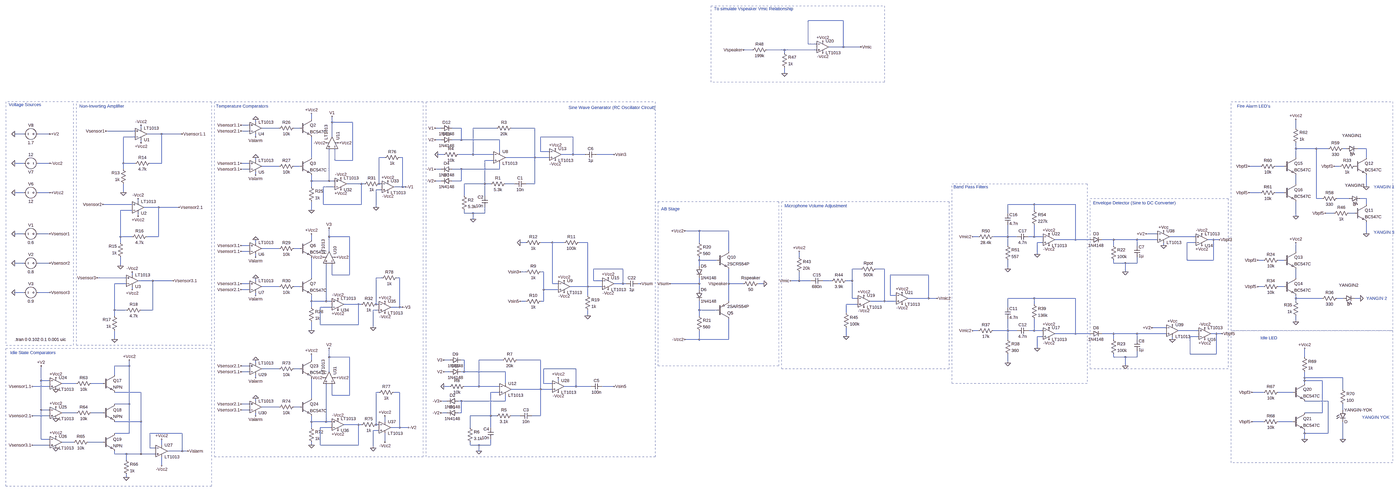
[diagram p0: schematic EE214_HalisYılmaz_RafetKavak_CircuitSchematic.asc, whole sheet]
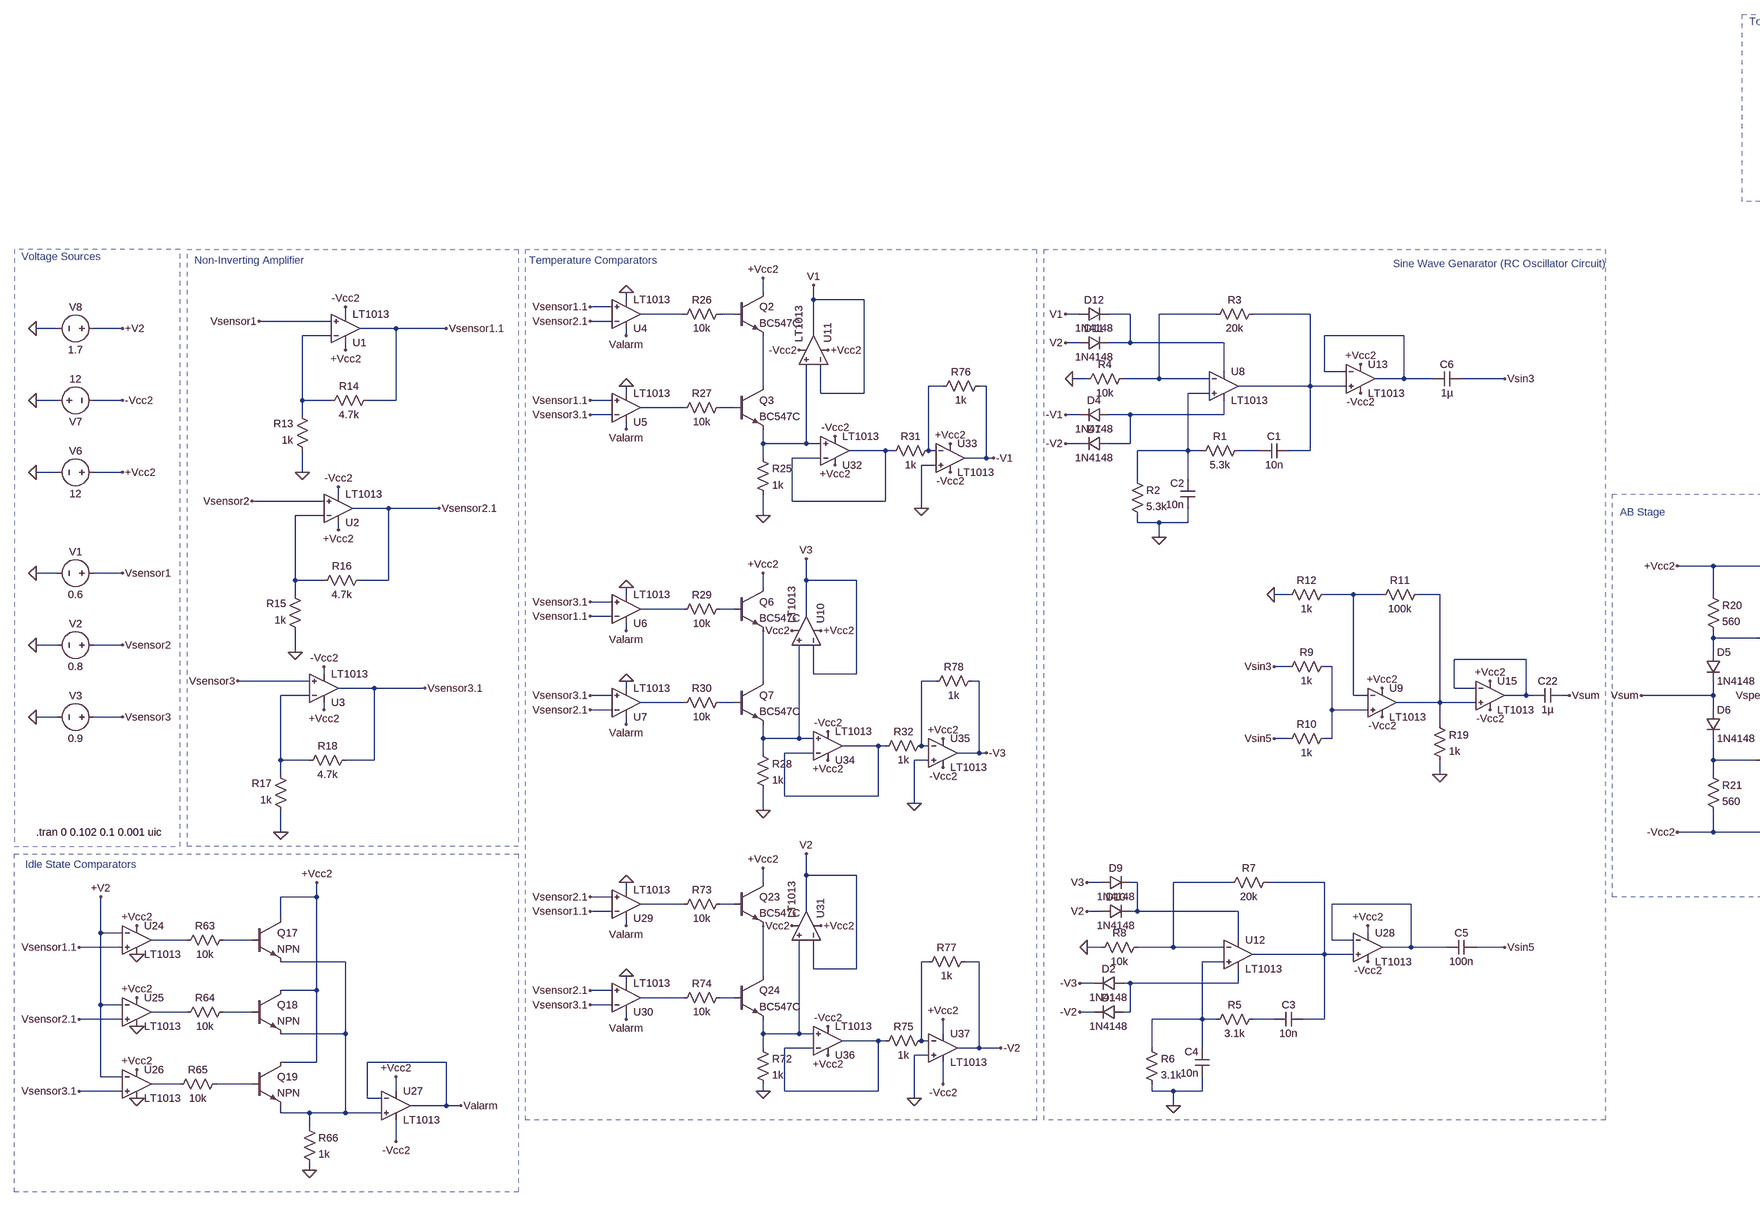
[diagram p1: schematic EE214_HalisYılmaz_RafetKavak_CircuitSchematic.asc, part, row 1 of 1, column 1 of 2]
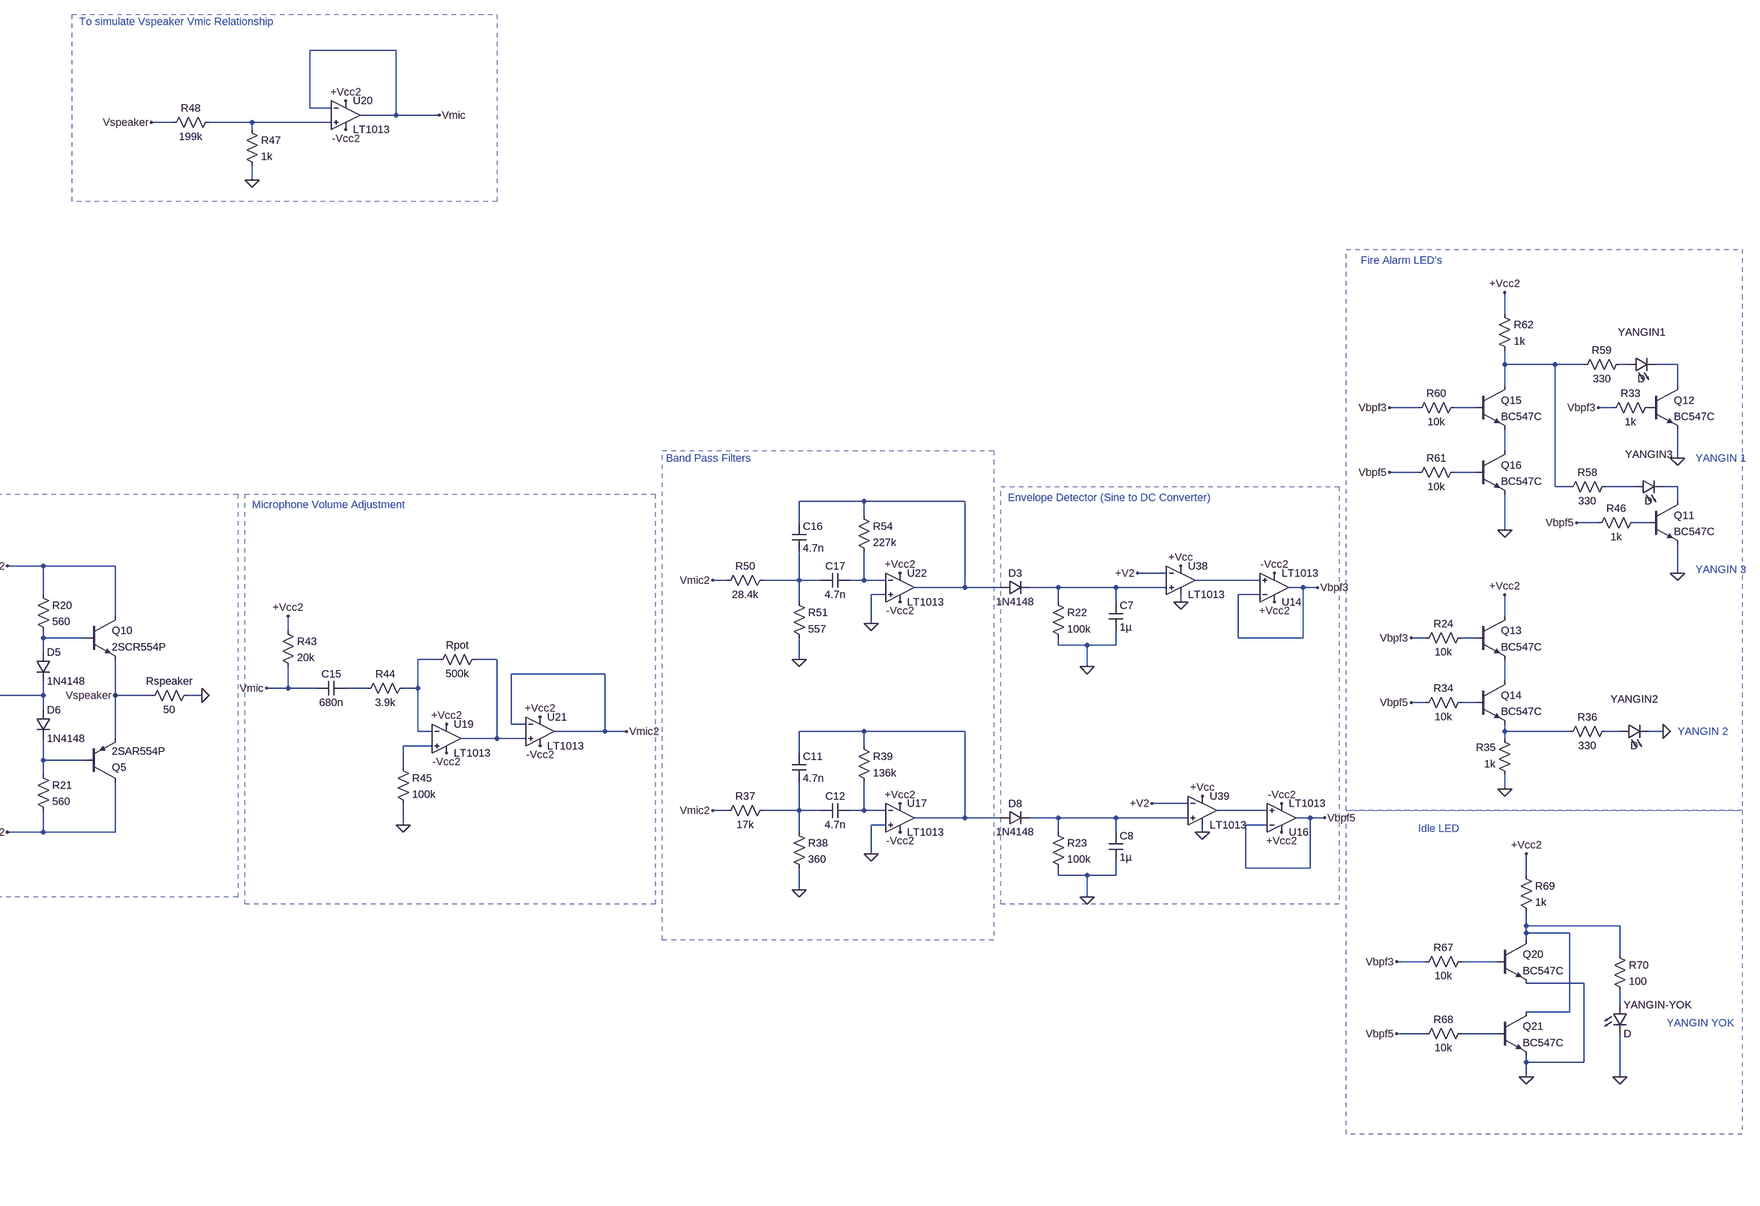
[diagram p2: schematic EE214_HalisYılmaz_RafetKavak_CircuitSchematic.asc, part, row 1 of 1, column 2 of 2]
EE214_HalisYılmaz_RafetKavak_CircuitSchematic.asc, the LTspice schematic file:
Version 4
SHEET 1 8176 2900
WIRE 2816 -976 2624 -976
WIRE 2624 -848 2624 -976
WIRE 2672 -848 2624 -848
WIRE 2816 -832 2816 -976
WIRE 2816 -832 2736 -832
WIRE 2912 -832 2816 -832
WIRE 2320 -816 2272 -816
WIRE 2496 -816 2400 -816
WIRE 2672 -816 2496 -816
WIRE 2496 -800 2496 -816
WIRE 2496 -688 2496 -720
WIRE -80 -336 -80 -368
WIRE -384 -320 -384 -336
WIRE 32 -320 32 -352
WIRE 144 -320 32 -320
WIRE -416 -304 -464 -304
WIRE -1008 -288 -1008 -304
WIRE -256 -288 -352 -288
WIRE -144 -288 -176 -288
WIRE 624 -288 592 -288
WIRE 736 -288 688 -288
WIRE 928 -288 800 -288
WIRE 1136 -288 1008 -288
WIRE 5280 -288 5280 -336
WIRE -1040 -272 -1200 -272
WIRE -416 -272 -464 -272
WIRE -1648 -256 -1696 -256
WIRE -1504 -256 -1568 -256
WIRE -896 -256 -976 -256
WIRE -784 -256 -896 -256
WIRE -1040 -240 -1104 -240
WIRE -384 -240 -384 -256
WIRE 32 -240 32 -320
WIRE 1344 -240 1168 -240
WIRE 624 -224 592 -224
WIRE 736 -224 736 -288
WIRE 736 -224 688 -224
WIRE 944 -224 736 -224
WIRE -1008 -208 -1008 -224
WIRE 5280 -176 5280 -208
WIRE 5392 -176 5280 -176
WIRE 5456 -176 5392 -176
WIRE 5552 -176 5536 -176
WIRE 5664 -176 5616 -176
WIRE 944 -160 944 -224
WIRE 1168 -160 1168 -240
WIRE 1216 -160 1168 -160
WIRE 640 -144 608 -144
WIRE 800 -144 800 -288
WIRE 800 -144 720 -144
WIRE 912 -144 800 -144
WIRE 1344 -144 1344 -240
WIRE 1344 -144 1280 -144
WIRE 1408 -144 1344 -144
WIRE 1568 -144 1472 -144
WIRE -80 -128 -80 -240
WIRE 320 -128 288 -128
WIRE 416 -128 400 -128
WIRE 1136 -128 1136 -288
WIRE 1136 -128 976 -128
WIRE 1216 -128 1136 -128
WIRE 5280 -128 5280 -176
WIRE 5664 -128 5664 -176
WIRE -384 -112 -384 -128
WIRE 48 -112 48 -176
WIRE 144 -112 144 -320
WIRE 144 -112 48 -112
WIRE 912 -112 864 -112
WIRE -1648 -96 -1696 -96
WIRE -1504 -96 -1568 -96
WIRE -1104 -96 -1104 -240
WIRE -1040 -96 -1104 -96
WIRE -896 -96 -896 -256
WIRE -896 -96 -960 -96
WIRE -416 -96 -464 -96
WIRE -256 -80 -352 -80
WIRE -144 -80 -176 -80
WIRE 5088 -80 5024 -80
WIRE 5216 -80 5168 -80
WIRE 5520 -80 5488 -80
WIRE -1104 -64 -1104 -96
WIRE -416 -64 -464 -64
WIRE 624 -64 592 -64
WIRE 736 -64 688 -64
WIRE 944 -64 944 -96
WIRE 944 -64 736 -64
WIRE -384 -32 -384 -48
WIRE -80 0 -80 -32
WIRE 16 0 16 -176
WIRE 16 0 -80 0
WIRE 48 0 16 0
WIRE 624 0 592 0
WIRE 736 0 736 -64
WIRE 736 0 688 0
WIRE 192 16 112 16
WIRE 208 16 192 16
WIRE 288 16 288 -128
WIRE 304 16 288 16
WIRE 864 16 864 -112
WIRE 864 16 752 16
WIRE 896 16 864 16
WIRE 1024 16 976 16
WIRE 1136 16 1136 -128
WIRE 1136 16 1088 16
WIRE 5280 16 5280 -32
WIRE -80 32 -80 0
WIRE 48 32 -16 32
WIRE 416 32 416 -128
WIRE 416 32 368 32
WIRE 432 32 416 32
WIRE 5664 32 5664 -32
WIRE 304 48 272 48
WIRE -1648 64 -1696 64
WIRE -1504 64 -1568 64
WIRE -1104 64 -1104 16
WIRE 5088 64 5024 64
WIRE 5216 64 5168 64
WIRE 752 80 752 16
WIRE 864 80 864 16
WIRE 5392 96 5392 -176
WIRE 5424 96 5392 96
WIRE 5568 96 5504 96
WIRE 5664 96 5632 96
WIRE -1024 112 -1024 96
WIRE -1056 128 -1216 128
WIRE -16 128 -16 32
WIRE 192 128 192 16
WIRE 192 128 -16 128
WIRE 3856 128 3712 128
WIRE 4080 128 3856 128
WIRE 5664 128 5664 96
WIRE -912 144 -992 144
WIRE -800 144 -912 144
WIRE 272 144 272 48
WIRE -1056 160 -1120 160
WIRE -80 160 -80 112
WIRE 3856 160 3856 128
WIRE 752 176 752 160
WIRE 800 176 752 176
WIRE 864 176 864 144
WIRE 864 176 800 176
WIRE 3712 176 3712 128
WIRE 5488 176 5440 176
WIRE 5600 176 5568 176
WIRE -1024 192 -1024 176
WIRE 5280 192 5280 112
WIRE 800 208 800 176
WIRE 2032 272 1952 272
WIRE 2192 272 2032 272
WIRE -1648 288 -1696 288
WIRE -1504 288 -1568 288
WIRE 4528 288 4464 288
WIRE 5664 288 5664 224
WIRE -1120 304 -1120 160
WIRE -1056 304 -1120 304
WIRE -912 304 -912 144
WIRE -912 304 -976 304
WIRE 16 304 16 256
WIRE 128 304 16 304
WIRE 3552 304 3520 304
WIRE 3712 304 3712 240
WIRE 3712 304 3632 304
WIRE 3760 304 3712 304
WIRE 3856 304 3856 240
WIRE 3856 304 3824 304
WIRE 3904 304 3856 304
WIRE 4736 304 4592 304
WIRE -80 320 -80 288
WIRE 4080 320 4080 128
WIRE 4080 320 3968 320
WIRE 4160 320 4080 320
WIRE 4288 320 4224 320
WIRE 4416 320 4288 320
WIRE 4528 320 4416 320
WIRE 4832 320 4800 320
WIRE 4864 320 4832 320
WIRE -1120 336 -1120 304
WIRE -384 336 -384 320
WIRE 1088 336 1056 336
WIRE 1232 336 1168 336
WIRE 1296 336 1232 336
WIRE 1424 336 1376 336
WIRE 2032 336 2032 272
WIRE 3904 336 3872 336
WIRE 4736 336 4688 336
WIRE -416 352 -464 352
WIRE 3712 352 3712 304
WIRE 4288 352 4288 320
WIRE 4416 352 4416 320
WIRE 4560 352 4560 336
WIRE -256 368 -352 368
WIRE -144 368 -176 368
WIRE -416 384 -464 384
WIRE 16 384 16 304
WIRE 2192 384 2192 272
WIRE 5280 384 5280 336
WIRE 3872 400 3872 336
WIRE -384 416 -384 400
WIRE 2576 416 2576 384
WIRE 2032 432 2032 416
WIRE 2128 432 2032 432
WIRE 4688 432 4688 336
WIRE 4832 432 4832 320
WIRE 4832 432 4688 432
WIRE 5104 432 5072 432
WIRE 5216 432 5184 432
WIRE -1648 448 -1696 448
WIRE -1504 448 -1568 448
WIRE 4288 448 4288 432
WIRE 4352 448 4288 448
WIRE 4416 448 4416 416
WIRE 4416 448 4352 448
WIRE -1120 464 -1120 416
WIRE 2032 464 2032 432
WIRE 1616 480 1456 480
WIRE 2912 480 2864 480
WIRE 3040 480 2992 480
WIRE 3712 480 3712 432
WIRE 1088 496 1056 496
WIRE 1184 496 1168 496
WIRE 4352 496 4352 448
WIRE -1056 512 -1056 496
WIRE 32 512 32 448
WIRE 128 512 128 304
WIRE 128 512 32 512
WIRE 3280 512 3072 512
WIRE -1088 528 -1248 528
WIRE -80 528 -80 416
WIRE 304 528 272 528
WIRE 400 528 384 528
WIRE 5280 528 5280 480
WIRE -944 544 -1024 544
WIRE -832 544 -944 544
WIRE -384 544 -384 528
WIRE 1456 544 1456 480
WIRE 1504 544 1456 544
WIRE 2576 544 2576 496
WIRE 2576 544 2528 544
WIRE 2640 544 2576 544
WIRE 2752 544 2704 544
WIRE 2864 544 2864 480
WIRE 2864 544 2832 544
WIRE -1088 560 -1152 560
WIRE -416 560 -464 560
WIRE 1232 560 1232 336
WIRE 1264 560 1232 560
WIRE 1616 560 1616 480
WIRE 1616 560 1568 560
WIRE 1632 560 1616 560
WIRE 1712 560 1696 560
WIRE 2032 560 2032 528
WIRE 2032 560 1872 560
WIRE 2192 560 2192 480
WIRE 2272 560 2192 560
WIRE 2384 560 2352 560
WIRE -256 576 -352 576
WIRE -144 576 -176 576
WIRE 1424 576 1424 336
WIRE 1424 576 1328 576
WIRE 1504 576 1424 576
WIRE 5104 576 5072 576
WIRE 5216 576 5184 576
WIRE -1056 592 -1056 576
WIRE -416 592 -464 592
WIRE 1184 592 1184 496
WIRE 1264 592 1184 592
WIRE 2032 592 2032 560
WIRE -1648 608 -1696 608
WIRE -1504 608 -1568 608
WIRE -384 624 -384 608
WIRE 1424 624 1424 576
WIRE 3072 624 3072 512
WIRE 3104 624 3072 624
WIRE 2864 640 2864 544
WIRE 2896 640 2864 640
WIRE 3280 640 3280 512
WIRE 3280 640 3168 640
WIRE 3328 640 3280 640
WIRE 3856 640 3712 640
WIRE 4080 640 3856 640
WIRE 5280 640 5280 624
WIRE 5424 640 5280 640
WIRE 5536 640 5504 640
WIRE 5632 640 5600 640
WIRE -80 656 -80 624
WIRE 0 656 0 448
WIRE 0 656 -80 656
WIRE 32 656 0 656
WIRE 1088 656 1056 656
WIRE 1184 656 1184 592
WIRE 1184 656 1168 656
WIRE 2192 656 2192 560
WIRE 3040 656 3040 480
WIRE 3040 656 2960 656
WIRE 3104 656 3040 656
WIRE 5280 656 5280 640
WIRE 176 672 96 672
WIRE 192 672 176 672
WIRE 272 672 272 528
WIRE 288 672 272 672
WIRE 2896 672 2832 672
WIRE 3856 672 3856 640
WIRE -80 688 -80 656
WIRE 32 688 -32 688
WIRE 400 688 400 528
WIRE 400 688 352 688
WIRE 416 688 400 688
WIRE 3712 688 3712 640
WIRE -1152 704 -1152 560
WIRE -1088 704 -1152 704
WIRE -944 704 -944 544
WIRE -944 704 -1008 704
WIRE 288 704 256 704
WIRE 2032 704 2032 656
WIRE 2128 704 2032 704
WIRE 2832 720 2832 672
WIRE -1152 736 -1152 704
WIRE 1424 736 1424 704
WIRE 2032 736 2032 704
WIRE 5280 768 5280 736
WIRE -32 784 -32 688
WIRE 176 784 176 672
WIRE 176 784 -32 784
WIRE 256 800 256 704
WIRE 4576 800 4496 800
WIRE -80 816 -80 768
WIRE 3552 816 3520 816
WIRE 3712 816 3712 752
WIRE 3712 816 3632 816
WIRE 3760 816 3712 816
WIRE 3856 816 3856 752
WIRE 3856 816 3824 816
WIRE 3904 816 3856 816
WIRE 4752 816 4640 816
WIRE 4080 832 4080 640
WIRE 4080 832 3968 832
WIRE 4160 832 4080 832
WIRE 4288 832 4224 832
WIRE 4416 832 4288 832
WIRE 4576 832 4416 832
WIRE 4848 832 4816 832
WIRE 4880 832 4848 832
WIRE 2832 848 2832 800
WIRE 3904 848 3872 848
WIRE 4752 848 4704 848
WIRE -1152 864 -1152 816
WIRE 2032 864 2032 816
WIRE 2032 864 1952 864
WIRE 2192 864 2192 752
WIRE 2192 864 2032 864
WIRE 3712 864 3712 816
WIRE 4288 864 4288 832
WIRE 4416 864 4416 832
WIRE 4608 864 4608 848
WIRE 3872 912 3872 848
WIRE 4704 944 4704 848
WIRE 4848 944 4848 832
WIRE 4848 944 4704 944
WIRE 16 960 16 912
WIRE 128 960 16 960
WIRE 4288 960 4288 944
WIRE 4352 960 4288 960
WIRE 4416 960 4416 928
WIRE 4416 960 4352 960
WIRE 5328 960 5328 912
WIRE -80 976 -80 944
WIRE 672 976 640 976
WIRE 752 976 736 976
WIRE 960 976 832 976
WIRE 1168 976 1040 976
WIRE -384 992 -384 976
WIRE 3712 992 3712 944
WIRE -1072 1008 -1072 976
WIRE -1072 1008 -1152 1008
WIRE -416 1008 -464 1008
WIRE 4352 1008 4352 960
WIRE -256 1024 -352 1024
WIRE -144 1024 -176 1024
WIRE 1360 1024 1184 1024
WIRE -416 1040 -464 1040
WIRE 16 1040 16 960
WIRE 672 1040 640 1040
WIRE 752 1040 752 976
WIRE 752 1040 736 1040
WIRE 976 1040 752 1040
WIRE -1152 1056 -1152 1008
WIRE -384 1072 -384 1056
WIRE 5328 1072 5328 1040
WIRE 5536 1072 5328 1072
WIRE -1552 1088 -1552 1008
WIRE -1504 1088 -1552 1088
WIRE 1264 1088 1264 1072
WIRE 5328 1088 5328 1072
WIRE 5424 1088 5328 1088
WIRE -1360 1104 -1440 1104
WIRE -1216 1104 -1280 1104
WIRE 976 1104 976 1040
WIRE 1184 1104 1184 1024
WIRE 1232 1104 1184 1104
WIRE 5328 1104 5328 1088
WIRE -1504 1120 -1600 1120
WIRE 672 1120 640 1120
WIRE 832 1120 832 976
WIRE 832 1120 752 1120
WIRE 944 1120 832 1120
WIRE 1360 1120 1360 1024
WIRE 1360 1120 1296 1120
WIRE 1440 1120 1360 1120
WIRE 1568 1120 1504 1120
WIRE 1168 1136 1168 976
WIRE 1168 1136 1008 1136
WIRE 1232 1136 1168 1136
WIRE 5536 1136 5536 1072
WIRE -1008 1152 -1152 1152
WIRE 288 1152 272 1152
WIRE 400 1152 368 1152
WIRE 944 1152 896 1152
WIRE 5104 1152 5040 1152
WIRE 5264 1152 5184 1152
WIRE 32 1168 32 1104
WIRE 128 1168 128 960
WIRE 128 1168 32 1168
WIRE -80 1184 -80 1072
WIRE -384 1200 -384 1184
WIRE 656 1200 624 1200
WIRE 736 1200 720 1200
WIRE 976 1200 976 1168
WIRE 976 1200 736 1200
WIRE 5456 1200 5328 1200
WIRE -1072 1216 -1072 1008
WIRE -1072 1216 -1152 1216
WIRE -416 1216 -464 1216
WIRE -256 1232 -352 1232
WIRE -144 1232 -176 1232
WIRE -1552 1248 -1552 1088
WIRE -1504 1248 -1552 1248
WIRE -416 1248 -464 1248
WIRE 5536 1248 5536 1216
WIRE -1360 1264 -1440 1264
WIRE -1216 1264 -1280 1264
WIRE 656 1264 624 1264
WIRE 736 1264 736 1200
WIRE 736 1264 720 1264
WIRE 5424 1264 5424 1088
WIRE 5424 1264 5328 1264
WIRE -1504 1280 -1600 1280
WIRE -384 1280 -384 1264
WIRE 896 1280 896 1152
WIRE 896 1280 784 1280
WIRE 928 1280 896 1280
WIRE 1056 1280 1008 1280
WIRE 1168 1280 1168 1136
WIRE 1168 1280 1120 1280
WIRE -1008 1312 -1008 1152
WIRE -1008 1312 -1152 1312
WIRE -80 1312 -80 1280
WIRE 0 1312 0 1104
WIRE 0 1312 -80 1312
WIRE 32 1312 0 1312
WIRE 320 1312 320 1280
WIRE 5104 1312 5040 1312
WIRE 5264 1312 5184 1312
WIRE 176 1328 96 1328
WIRE 192 1328 176 1328
WIRE 272 1328 272 1152
WIRE 288 1328 272 1328
WIRE -80 1344 -80 1312
WIRE 32 1344 -32 1344
WIRE 400 1344 400 1152
WIRE 400 1344 352 1344
WIRE 448 1344 400 1344
WIRE 784 1344 784 1280
WIRE 896 1344 896 1280
WIRE 288 1360 256 1360
WIRE -1072 1376 -1072 1216
WIRE -1072 1376 -1152 1376
WIRE -784 1376 -960 1376
WIRE 5328 1376 5328 1360
WIRE 5456 1376 5456 1200
WIRE 5456 1376 5328 1376
WIRE -1552 1408 -1552 1248
WIRE -1504 1408 -1552 1408
WIRE 5328 1408 5328 1376
WIRE 5536 1408 5536 1312
WIRE -1376 1424 -1440 1424
WIRE -1216 1424 -1296 1424
WIRE 320 1424 320 1376
WIRE -1504 1440 -1600 1440
WIRE -896 1440 -896 1408
WIRE -80 1440 -80 1424
WIRE -32 1440 -32 1344
WIRE 176 1440 176 1328
WIRE 176 1440 -32 1440
WIRE 784 1440 784 1424
WIRE 832 1440 784 1440
WIRE 896 1440 896 1408
WIRE 896 1440 832 1440
WIRE -960 1456 -960 1376
WIRE -928 1456 -960 1456
WIRE 256 1456 256 1360
WIRE -784 1472 -784 1376
WIRE -784 1472 -864 1472
WIRE -752 1472 -784 1472
WIRE 832 1472 832 1440
WIRE -1152 1488 -1152 1472
WIRE -1088 1488 -1152 1488
WIRE -1008 1488 -1008 1312
WIRE -1008 1488 -1088 1488
WIRE -928 1488 -1008 1488
WIRE -1088 1520 -1088 1488
WIRE -896 1552 -896 1504
WIRE -1088 1616 -1088 1600
FLAG -1696 288 0
FLAG -1696 448 0
FLAG -1696 608 0
FLAG -1104 64 0
FLAG -1120 464 0
FLAG -1152 864 0
FLAG -1008 -208 +Vcc2
FLAG -1024 192 +Vcc2
FLAG -1056 592 +Vcc2
FLAG -1008 -304 -Vcc2
FLAG -1024 96 -Vcc2
FLAG -1056 496 -Vcc2
FLAG -1504 288 Vsensor1
FLAG -1200 -272 Vsensor1
FLAG -1504 448 Vsensor2
FLAG -1216 128 Vsensor2
FLAG -1504 608 Vsensor3
FLAG -1248 528 Vsensor3
FLAG -784 -256 Vsensor1.1
FLAG -800 144 Vsensor2.1
FLAG -384 -240 Valarm
FLAG -80 160 0
FLAG -80 -368 +Vcc2
FLAG -464 -304 Vsensor1.1
FLAG -464 -96 Vsensor1.1
FLAG -384 -32 Valarm
FLAG -464 -272 Vsensor2.1
FLAG -832 544 Vsensor3.1
FLAG -464 -64 Vsensor3.1
FLAG -384 416 Valarm
FLAG -80 816 0
FLAG -384 624 Valarm
FLAG -464 384 Vsensor1.1
FLAG -464 560 Vsensor3.1
FLAG 16 256 V3
FLAG 32 -352 V1
FLAG -384 320 0
FLAG -384 -336 0
FLAG -384 -128 0
FLAG -384 528 0
FLAG -1696 64 0
FLAG -1504 64 +Vcc2
FLAG 48 416 +Vcc2
FLAG 64 -208 +Vcc2
FLAG 0 -208 -Vcc2
FLAG -16 416 -Vcc2
FLAG 1296 544 +Vcc2
FLAG 1296 608 -Vcc2
FLAG 1056 336 0
FLAG 1424 736 0
FLAG -1696 -96 0
FLAG -1504 -96 -Vcc2
FLAG 1872 560 Vsum
FLAG 1712 560 Vsum
FLAG 1952 272 +Vcc2
FLAG 1952 864 -Vcc2
FLAG 2272 -816 Vspeaker
FLAG 2912 -832 Vmic
FLAG 2528 544 Vmic
FLAG 2928 624 +Vcc2
FLAG 2928 688 -Vcc2
FLAG 2832 848 0
FLAG 2704 -864 +Vcc2
FLAG 2704 -800 -Vcc2
FLAG 2496 -688 0
FLAG 3328 640 Vmic2
FLAG 3136 608 +Vcc2
FLAG 3136 672 -Vcc2
FLAG 2576 384 +Vcc2
FLAG 3712 480 0
FLAG 3872 400 0
FLAG 3936 288 +Vcc2
FLAG 3936 352 -Vcc2
FLAG 3520 304 Vmic2
FLAG 3712 992 0
FLAG 3872 912 0
FLAG 3936 800 +Vcc2
FLAG 3936 864 -Vcc2
FLAG 3520 816 Vmic2
FLAG 4352 496 0
FLAG 4352 1008 0
FLAG 4864 320 Vbpf3
FLAG 4880 832 Vbpf5
FLAG 5280 768 0
FLAG 5280 336 +Vcc2
FLAG 5664 32 0
FLAG 5664 288 0
FLAG 5632 640 0
FLAG 5072 432 Vbpf3
FLAG 5072 576 Vbpf5
FLAG 5280 192 0
FLAG 5280 -336 +Vcc2
FLAG 5024 -80 Vbpf3
FLAG 5024 64 Vbpf5
FLAG 4784 864 +Vcc2
FLAG 4768 352 +Vcc2
FLAG 4768 288 -Vcc2
FLAG 4784 800 -Vcc2
FLAG -464 592 Vsensor2.1
FLAG -464 352 Vsensor3.1
FLAG -1696 -256 0
FLAG -1504 -256 +V2
FLAG -1072 976 +Vcc2
FLAG -1088 1616 0
FLAG -1552 1008 +V2
FLAG -1600 1120 Vsensor1.1
FLAG -1600 1280 Vsensor2.1
FLAG -1600 1440 Vsensor3.1
FLAG -1472 1136 0
FLAG -1472 1296 0
FLAG -1472 1456 0
FLAG -1472 1392 +Vcc2
FLAG -1472 1232 +Vcc2
FLAG -1472 1072 +Vcc2
FLAG 5040 1152 Vbpf3
FLAG 5040 1312 Vbpf5
FLAG 5328 912 +Vcc2
FLAG 5328 1408 0
FLAG 5536 1408 0
FLAG 1536 528 +Vcc2
FLAG 1536 592 -Vcc2
FLAG -752 1472 Valarm
FLAG -896 1408 +Vcc2
FLAG -896 1552 -Vcc2
FLAG -80 288 +Vcc2
FLAG 2192 560 Vspeaker
FLAG 2384 560 0
FLAG -384 1072 Valarm
FLAG -80 1440 0
FLAG -384 1280 Valarm
FLAG -464 1040 Vsensor1.1
FLAG -464 1216 Vsensor2.1
FLAG 16 912 V2
FLAG -384 976 0
FLAG -384 1184 0
FLAG 48 1072 +Vcc2
FLAG -16 1072 -Vcc2
FLAG -464 1248 Vsensor3.1
FLAG -464 1008 Vsensor2.1
FLAG -80 944 +Vcc2
FLAG 5488 -80 Vbpf3
FLAG 5440 176 Vbpf5
FLAG 1056 496 Vsin3
FLAG 1056 656 Vsin5
FLAG 800 208 0
FLAG 608 -144 0
FLAG 832 1472 0
FLAG 640 1120 0
FLAG 1568 -144 Vsin3
FLAG 1248 -176 +Vcc2
FLAG 1248 -112 -Vcc2
FLAG 1264 1072 +Vcc2
FLAG 1264 1152 -Vcc2
FLAG 1568 1120 Vsin5
FLAG 592 -288 V1
FLAG 592 -224 V2
FLAG 640 1040 V2
FLAG 640 976 V3
FLAG 80 48 +Vcc2
FLAG 80 -16 -Vcc2
FLAG 432 32 -V1
FLAG 272 144 0
FLAG 336 0 +Vcc2
FLAG 336 64 -Vcc2
FLAG 64 704 +Vcc2
FLAG 64 640 -Vcc2
FLAG 416 688 -V3
FLAG 256 800 0
FLAG 320 656 +Vcc2
FLAG 320 720 -Vcc2
FLAG 64 1360 +Vcc2
FLAG 64 1296 -Vcc2
FLAG 448 1344 -V2
FLAG 256 1456 0
FLAG 320 1280 +Vcc2
FLAG 320 1424 -Vcc2
FLAG 624 1264 -V2
FLAG 624 1200 -V3
FLAG 592 -64 -V1
FLAG 592 0 -V2
FLAG 4560 272 +Vcc
FLAG 4608 784 +Vcc
FLAG 4560 352 0
FLAG 4608 864 0
FLAG 4464 288 +V2
FLAG 4496 800 +V2
SYMBOL voltage -1552 288 R90
WINDOW 0 -32 56 VBottom 2
WINDOW 3 32 56 VTop 2
WINDOW 123 0 0 Left 2
WINDOW 39 0 0 Left 2
SYMATTR InstName V1
SYMATTR Value 0.6
SYMBOL voltage -1552 448 R90
WINDOW 0 -32 56 VBottom 2
WINDOW 3 32 56 VTop 2
WINDOW 123 0 0 Left 2
WINDOW 39 0 0 Left 2
SYMATTR InstName V2
SYMATTR Value 0.8
SYMBOL voltage -1552 608 R90
WINDOW 0 -32 56 VBottom 2
WINDOW 3 32 56 VTop 2
WINDOW 123 0 0 Left 2
WINDOW 39 0 0 Left 2
SYMATTR InstName V3
SYMATTR Value 0.9
SYMBOL Opamps\\LT1013 -1008 -192 M180
SYMATTR InstName U1
SYMBOL res -1088 32 R180
WINDOW 0 36 76 Left 2
WINDOW 3 36 40 Left 2
SYMATTR InstName R13
SYMATTR Value 1k
SYMBOL res -1056 -80 R270
WINDOW 0 32 56 VTop 2
WINDOW 3 0 56 VBottom 2
SYMATTR InstName R14
SYMATTR Value 4.7k
SYMBOL Opamps\\LT1013 -1024 208 M180
SYMATTR InstName U2
SYMBOL res -1104 432 R180
WINDOW 0 36 76 Left 2
WINDOW 3 36 40 Left 2
SYMATTR InstName R15
SYMATTR Value 1k
SYMBOL res -1072 320 R270
WINDOW 0 32 56 VTop 2
WINDOW 3 0 56 VBottom 2
SYMATTR InstName R16
SYMATTR Value 4.7k
SYMBOL Opamps\\LT1013 -1056 608 M180
SYMATTR InstName U3
SYMBOL res -1136 832 R180
WINDOW 0 36 76 Left 2
WINDOW 3 36 40 Left 2
SYMATTR InstName R17
SYMATTR Value 1k
SYMBOL res -1104 720 R270
WINDOW 0 32 56 VTop 2
WINDOW 3 0 56 VBottom 2
SYMATTR InstName R18
SYMATTR Value 4.7k
SYMBOL Opamps\\LT1013 -384 -224 M180
SYMATTR InstName U4
SYMBOL npn -144 -336 R0
SYMATTR InstName Q2
SYMATTR Value BC547C
SYMBOL npn -144 -128 R0
SYMATTR InstName Q3
SYMATTR Value BC547C
SYMBOL res -96 16 R0
SYMATTR InstName R25
SYMATTR Value 1k
SYMBOL Opamps\\LT1013 -384 -16 M180
SYMATTR InstName U5
SYMBOL res -160 -304 R90
WINDOW 0 0 56 VBottom 2
WINDOW 3 32 56 VTop 2
SYMATTR InstName R26
SYMATTR Value 10k
SYMBOL res -160 -96 R90
WINDOW 0 0 56 VBottom 2
WINDOW 3 32 56 VTop 2
SYMATTR InstName R27
SYMATTR Value 10k
SYMBOL Opamps\\LT1013 -384 432 M180
SYMATTR InstName U6
SYMBOL npn -144 320 R0
SYMATTR InstName Q6
SYMATTR Value BC547C
SYMBOL npn -144 528 R0
SYMATTR InstName Q7
SYMATTR Value BC547C
SYMBOL res -96 672 R0
SYMATTR InstName R28
SYMATTR Value 1k
SYMBOL Opamps\\LT1013 -384 640 M180
SYMATTR InstName U7
SYMBOL res -160 352 R90
WINDOW 0 0 56 VBottom 2
WINDOW 3 32 56 VTop 2
SYMATTR InstName R29
SYMATTR Value 10k
SYMBOL res -160 560 R90
WINDOW 0 0 56 VBottom 2
WINDOW 3 32 56 VTop 2
SYMATTR InstName R30
SYMATTR Value 10k
SYMBOL voltage -1552 64 R90
WINDOW 0 -32 56 VBottom 2
WINDOW 3 32 56 VTop 2
WINDOW 123 0 0 Left 2
WINDOW 39 0 0 Left 2
SYMATTR InstName V6
SYMATTR Value 12
SYMBOL Opamps\\LT1013 80 416 M270
SYMATTR InstName U10
SYMBOL Opamps\\LT1013 96 -208 M270
SYMATTR InstName U11
SYMBOL Opamps\\LT1013 1296 512 R0
SYMATTR InstName U9
SYMBOL res 1184 480 R90
WINDOW 0 0 56 VBottom 2
WINDOW 3 32 56 VTop 2
SYMATTR InstName R9
SYMATTR Value 1k
SYMBOL res 1184 640 R90
WINDOW 0 0 56 VBottom 2
WINDOW 3 32 56 VTop 2
SYMATTR InstName R10
SYMATTR Value 1k
SYMBOL res 1392 320 R90
WINDOW 0 0 56 VBottom 2
WINDOW 3 32 56 VTop 2
SYMATTR InstName R11
SYMATTR Value 100k
SYMBOL res 1184 320 R90
WINDOW 0 0 56 VBottom 2
WINDOW 3 32 56 VTop 2
SYMATTR InstName R12
SYMATTR Value 1k
SYMBOL res 1408 608 R0
SYMATTR InstName R19
SYMATTR Value 1k
SYMBOL voltage -1664 -96 R270
WINDOW 0 -32 56 VBottom 2
WINDOW 3 32 56 VTop 2
WINDOW 123 0 0 Left 2
WINDOW 39 0 0 Left 2
SYMATTR InstName V7
SYMATTR Value 12
SYMBOL diode 2016 464 R0
SYMATTR InstName D5
SYMATTR Value 1N4148
SYMBOL diode 2016 592 R0
SYMATTR InstName D6
SYMATTR Value 1N4148
SYMBOL res 2016 320 R0
SYMATTR InstName R20
SYMATTR Value 560
SYMBOL res 2016 720 R0
SYMATTR InstName R21
SYMATTR Value 560
SYMBOL pnp 2128 752 M180
SYMATTR InstName Q5
SYMATTR Value 2SAR554P
SYMBOL npn 2128 384 R0
SYMATTR InstName Q10
SYMATTR Value 2SCR554P
SYMBOL Opamps\\LT1013 1536 496 R0
SYMATTR InstName U15
SYMBOL res 2256 576 R270
WINDOW 0 32 56 VTop 2
WINDOW 3 0 56 VBottom 2
SYMATTR InstName Rspeaker
SYMATTR Value 50
SYMBOL res 2560 400 R0
SYMATTR InstName R43
SYMATTR Value 20k
SYMBOL cap 2704 528 R90
WINDOW 0 0 32 VBottom 2
WINDOW 3 32 32 VTop 2
SYMATTR InstName C15
SYMATTR Value 680n
SYMBOL res 2848 528 R90
WINDOW 0 0 56 VBottom 2
WINDOW 3 32 56 VTop 2
SYMATTR InstName R44
SYMATTR Value 3.9k
SYMBOL Opamps\\LT1013 2928 592 R0
SYMATTR InstName U19
SYMBOL res 2816 704 R0
SYMATTR InstName R45
SYMATTR Value 100k
SYMBOL res 3008 464 R90
WINDOW 0 0 56 VBottom 2
WINDOW 3 32 56 VTop 2
SYMATTR InstName Rpot
SYMATTR Value 500k
SYMBOL Opamps\\LT1013 2704 -896 R0
SYMATTR InstName U20
SYMBOL res 2480 -816 R0
SYMATTR InstName R47
SYMATTR Value 1k
SYMBOL res 2416 -832 R90
WINDOW 0 0 56 VBottom 2
WINDOW 3 32 56 VTop 2
SYMATTR InstName R48
SYMATTR Value 199k
SYMBOL Opamps\\LT1013 3136 576 R0
SYMATTR InstName U21
SYMBOL res 3648 288 R90
WINDOW 0 0 56 VBottom 2
WINDOW 3 32 56 VTop 2
SYMATTR InstName R50
SYMATTR Value 28.4k
SYMBOL res 3696 336 R0
SYMATTR InstName R51
SYMATTR Value 557
SYMBOL cap 3696 176 R0
SYMATTR InstName C16
SYMATTR Value 4.7n
SYMBOL Opamps\\LT1013 3936 256 R0
SYMATTR InstName U22
SYMBOL cap 3824 288 R90
WINDOW 0 0 32 VBottom 2
WINDOW 3 32 32 VTop 2
SYMATTR InstName C17
SYMATTR Value 4.7n
SYMBOL res 3840 144 R0
SYMATTR InstName R54
SYMATTR Value 227k
SYMBOL res 3648 800 R90
WINDOW 0 0 56 VBottom 2
WINDOW 3 32 56 VTop 2
SYMATTR InstName R37
SYMATTR Value 17k
SYMBOL res 3696 848 R0
SYMATTR InstName R38
SYMATTR Value 360
SYMBOL cap 3696 688 R0
SYMATTR InstName C11
SYMATTR Value 4.7n
SYMBOL Opamps\\LT1013 3936 768 R0
SYMATTR InstName U17
SYMBOL cap 3824 800 R90
WINDOW 0 0 32 VBottom 2
WINDOW 3 32 32 VTop 2
SYMATTR InstName C12
SYMATTR Value 4.7n
SYMBOL res 3840 656 R0
SYMATTR InstName R39
SYMATTR Value 136k
SYMBOL diode 4160 336 R270
WINDOW 0 32 32 VTop 2
WINDOW 3 0 32 VBottom 2
SYMATTR InstName D3
SYMATTR Value 1N4148
SYMBOL cap 4400 352 R0
SYMATTR InstName C7
SYMATTR Value 1µ
SYMBOL res 4272 336 R0
SYMATTR InstName R22
SYMATTR Value 100k
SYMBOL diode 4160 848 R270
WINDOW 0 32 32 VTop 2
WINDOW 3 0 32 VBottom 2
SYMATTR InstName D8
SYMATTR Value 1N4148
SYMBOL cap 4400 864 R0
SYMATTR InstName C8
SYMATTR Value 1µ
SYMBOL res 4272 848 R0
SYMATTR InstName R23
SYMATTR Value 100k
SYMBOL npn 5216 384 R0
SYMATTR InstName Q13
SYMATTR Value BC547C
SYMBOL npn 5216 528 R0
SYMATTR InstName Q14
SYMATTR Value BC547C
SYMBOL res 5200 416 R90
WINDOW 0 0 56 VBottom 2
WINDOW 3 32 56 VTop 2
SYMATTR InstName R24
SYMATTR Value 10k
SYMBOL res 5200 560 R90
WINDOW 0 0 56 VBottom 2
WINDOW 3 32 56 VTop 2
SYMATTR InstName R34
SYMATTR Value 10k
SYMBOL res 5296 752 R180
WINDOW 0 36 76 Left 2
WINDOW 3 36 40 Left 2
SYMATTR InstName R35
SYMATTR Value 1k
SYMBOL LED 5536 656 R270
WINDOW 0 72 32 VTop 2
WINDOW 3 0 32 VBottom 2
SYMATTR InstName YANGIN2
SYMBOL res 5520 624 R90
WINDOW 0 0 56 VBottom 2
WINDOW 3 32 56 VTop 2
SYMATTR InstName R36
SYMATTR Value 330
SYMBOL LED 5568 112 R270
WINDOW 0 72 32 VTop 2
WINDOW 3 0 32 VBottom 2
SYMATTR InstName YANGIN3
SYMBOL res 5520 80 R90
WINDOW 0 0 56 VBottom 2
WINDOW 3 32 56 VTop 2
SYMATTR InstName R58
SYMATTR Value 330
SYMBOL LED 5552 -160 R270
WINDOW 0 72 32 VTop 2
WINDOW 3 0 32 VBottom 2
SYMATTR InstName YANGIN1
SYMBOL res 5552 -192 R90
WINDOW 0 0 56 VBottom 2
WINDOW 3 32 56 VTop 2
SYMATTR InstName R59
SYMATTR Value 330
SYMBOL res 5184 -96 R90
WINDOW 0 0 56 VBottom 2
WINDOW 3 32 56 VTop 2
SYMATTR InstName R60
SYMATTR Value 10k
SYMBOL res 5184 48 R90
WINDOW 0 0 56 VBottom 2
WINDOW 3 32 56 VTop 2
SYMATTR InstName R61
SYMATTR Value 10k
SYMBOL npn 5216 -128 R0
SYMATTR InstName Q15
SYMATTR Value BC547C
SYMBOL npn 5216 16 R0
SYMATTR InstName Q16
SYMATTR Value BC547C
SYMBOL res 5264 -304 R0
SYMATTR InstName R62
SYMATTR Value 1k
SYMBOL Opamps\\LT1013 4768 384 M180
SYMATTR InstName U14
SYMBOL Opamps\\LT1013 4784 896 M180
SYMATTR InstName U16
SYMBOL voltage -1552 -256 R90
WINDOW 0 -32 56 VBottom 2
WINDOW 3 32 56 VTop 2
WINDOW 123 0 0 Left 2
WINDOW 39 0 0 Left 2
SYMATTR InstName V8
SYMATTR Value 1.7
SYMBOL Opamps\\LT1013 -1472 1040 R0
SYMATTR InstName U24
SYMBOL Opamps\\LT1013 -1472 1200 R0
SYMATTR InstName U25
SYMBOL Opamps\\LT1013 -1472 1360 R0
SYMATTR InstName U26
SYMBOL npn -1216 1056 R0
SYMATTR InstName Q17
SYMBOL npn -1216 1216 R0
SYMATTR InstName Q18
SYMBOL npn -1216 1376 R0
SYMATTR InstName Q19
SYMBOL res -1264 1088 R90
WINDOW 0 0 56 VBottom 2
WINDOW 3 32 56 VTop 2
SYMATTR InstName R63
SYMATTR Value 10k
SYMBOL res -1264 1248 R90
WINDOW 0 0 56 VBottom 2
WINDOW 3 32 56 VTop 2
SYMATTR InstName R64
SYMATTR Value 10k
SYMBOL res -1280 1408 R90
WINDOW 0 0 56 VBottom 2
WINDOW 3 32 56 VTop 2
SYMATTR InstName R65
SYMATTR Value 10k
SYMBOL res -1104 1504 R0
SYMATTR InstName R66
SYMATTR Value 1k
SYMBOL res 5200 1136 R90
WINDOW 0 0 56 VBottom 2
WINDOW 3 32 56 VTop 2
SYMATTR InstName R67
SYMATTR Value 10k
SYMBOL res 5200 1296 R90
WINDOW 0 0 56 VBottom 2
WINDOW 3 32 56 VTop 2
SYMATTR InstName R68
SYMATTR Value 10k
SYMBOL npn 5264 1104 R0
SYMATTR InstName Q20
SYMATTR Value BC547C
SYMBOL npn 5264 1264 R0
SYMATTR InstName Q21
SYMATTR Value BC547C
SYMBOL res 5312 944 R0
SYMATTR InstName R69
SYMATTR Value 1k
SYMBOL res 5520 1120 R0
SYMATTR InstName R70
SYMATTR Value 100
SYMBOL LED 5520 1248 R0
SYMATTR InstName YANGIN-YOK
SYMBOL Opamps\\LT1013 -896 1408 R0
SYMATTR InstName U27
SYMBOL npn 5600 128 R0
SYMATTR InstName Q11
SYMATTR Value BC547C
SYMBOL npn 5600 -128 R0
SYMATTR InstName Q12
SYMATTR Value BC547C
SYMBOL Opamps\\LT1013 -384 1088 M180
SYMATTR InstName U29
SYMBOL npn -144 976 R0
SYMATTR InstName Q23
SYMATTR Value BC547C
SYMBOL npn -144 1184 R0
SYMATTR InstName Q24
SYMATTR Value BC547C
SYMBOL res -96 1328 R0
SYMATTR InstName R72
SYMATTR Value 1k
SYMBOL Opamps\\LT1013 -384 1296 M180
SYMATTR InstName U30
SYMBOL res -160 1008 R90
WINDOW 0 0 56 VBottom 2
WINDOW 3 32 56 VTop 2
SYMATTR InstName R73
SYMATTR Value 10k
SYMBOL res -160 1216 R90
WINDOW 0 0 56 VBottom 2
WINDOW 3 32 56 VTop 2
SYMATTR InstName R74
SYMATTR Value 10k
SYMBOL Opamps\\LT1013 80 1072 M270
SYMATTR InstName U31
SYMBOL res 5616 -96 R90
WINDOW 0 0 56 VBottom 2
WINDOW 3 32 56 VTop 2
SYMATTR InstName R33
SYMATTR Value 1k
SYMBOL res 5584 160 R90
WINDOW 0 0 56 VBottom 2
WINDOW 3 32 56 VTop 2
SYMATTR InstName R46
SYMATTR Value 1k
SYMBOL cap 1696 544 R90
WINDOW 0 0 32 VBottom 2
WINDOW 3 32 32 VTop 2
SYMATTR InstName C22
SYMATTR Value 1µ
SYMBOL Opamps\\LT1013 944 -192 R0
SYMATTR InstName U8
SYMBOL res 992 0 R90
WINDOW 0 0 56 VBottom 2
WINDOW 3 32 56 VTop 2
SYMATTR InstName R1
SYMATTR Value 5.3k
SYMBOL cap 1088 0 R90
WINDOW 0 0 32 VBottom 2
WINDOW 3 32 32 VTop 2
SYMATTR InstName C1
SYMATTR Value 10n
SYMBOL cap 880 144 R180
WINDOW 0 24 56 Left 2
WINDOW 3 24 8 Left 2
SYMATTR InstName C2
SYMATTR Value 10n
SYMBOL res 736 64 R0
SYMATTR InstName R2
SYMATTR Value 5.3k
SYMBOL res 1024 -304 R90
WINDOW 0 0 56 VBottom 2
WINDOW 3 32 56 VTop 2
SYMATTR InstName R3
SYMATTR Value 20k
SYMBOL res 736 -160 R90
WINDOW 0 0 56 VBottom 2
WINDOW 3 32 56 VTop 2
SYMATTR InstName R4
SYMATTR Value 10k
SYMBOL Opamps\\LT1013 976 1072 R0
SYMATTR InstName U12
SYMBOL res 1024 1264 R90
WINDOW 0 0 56 VBottom 2
WINDOW 3 32 56 VTop 2
SYMATTR InstName R5
SYMATTR Value 3.1k
SYMBOL cap 1120 1264 R90
WINDOW 0 0 32 VBottom 2
WINDOW 3 32 32 VTop 2
SYMATTR InstName C3
SYMATTR Value 10n
SYMBOL cap 912 1408 R180
WINDOW 0 24 56 Left 2
WINDOW 3 24 8 Left 2
SYMATTR InstName C4
SYMATTR Value 10n
SYMBOL res 768 1328 R0
SYMATTR InstName R6
SYMATTR Value 3.1k
SYMBOL res 1056 960 R90
WINDOW 0 0 56 VBottom 2
WINDOW 3 32 56 VTop 2
SYMATTR InstName R7
SYMATTR Value 20k
SYMBOL res 768 1104 R90
WINDOW 0 0 56 VBottom 2
WINDOW 3 32 56 VTop 2
SYMATTR InstName R8
SYMATTR Value 10k
SYMBOL Opamps\\LT1013 1248 -208 R0
SYMATTR InstName U13
SYMBOL Opamps\\LT1013 1264 1056 R0
SYMATTR InstName U28
SYMBOL diode 672 992 R270
WINDOW 0 32 32 VTop 2
WINDOW 3 0 32 VBottom 2
SYMATTR InstName D9
SYMATTR Value 1N4148
SYMBOL diode 672 1056 R270
WINDOW 0 32 32 VTop 2
WINDOW 3 0 32 VBottom 2
SYMATTR InstName D10
SYMATTR Value 1N4148
SYMBOL diode 624 -208 R270
WINDOW 0 32 32 VTop 2
WINDOW 3 0 32 VBottom 2
SYMATTR InstName D11
SYMATTR Value 1N4148
SYMBOL diode 624 -272 R270
WINDOW 0 32 32 VTop 2
WINDOW 3 0 32 VBottom 2
SYMATTR InstName D12
SYMATTR Value 1N4148
SYMBOL Opamps\\LT1013 80 80 M180
SYMATTR InstName U32
SYMBOL Opamps\\LT1013 336 -32 R0
SYMATTR InstName U33
SYMBOL res 304 0 R90
WINDOW 0 0 56 VBottom 2
WINDOW 3 32 56 VTop 2
SYMATTR InstName R31
SYMATTR Value 1k
SYMBOL Opamps\\LT1013 64 736 M180
SYMATTR InstName U34
SYMBOL Opamps\\LT1013 320 624 R0
SYMATTR InstName U35
SYMBOL res 288 656 R90
WINDOW 0 0 56 VBottom 2
WINDOW 3 32 56 VTop 2
SYMATTR InstName R32
SYMATTR Value 1k
SYMBOL Opamps\\LT1013 64 1392 M180
SYMATTR InstName U36
SYMBOL Opamps\\LT1013 320 1280 R0
SYMATTR InstName U37
SYMBOL res 288 1312 R90
WINDOW 0 0 56 VBottom 2
WINDOW 3 32 56 VTop 2
SYMATTR InstName R75
SYMATTR Value 1k
SYMBOL res 416 -144 R90
WINDOW 0 0 56 VBottom 2
WINDOW 3 32 56 VTop 2
SYMATTR InstName R76
SYMATTR Value 1k
SYMBOL res 384 1136 R90
WINDOW 0 0 56 VBottom 2
WINDOW 3 32 56 VTop 2
SYMATTR InstName R77
SYMATTR Value 1k
SYMBOL res 400 512 R90
WINDOW 0 0 56 VBottom 2
WINDOW 3 32 56 VTop 2
SYMATTR InstName R78
SYMATTR Value 1k
SYMBOL diode 688 -80 R90
WINDOW 0 0 32 VBottom 2
WINDOW 3 32 32 VTop 2
SYMATTR InstName D4
SYMATTR Value 1N4148
SYMBOL diode 688 -16 R90
WINDOW 0 0 32 VBottom 2
WINDOW 3 32 32 VTop 2
SYMATTR InstName D7
SYMATTR Value 1N4148
SYMBOL diode 720 1248 R90
WINDOW 0 0 32 VBottom 2
WINDOW 3 32 32 VTop 2
SYMATTR InstName D1
SYMATTR Value 1N4148
SYMBOL diode 720 1184 R90
WINDOW 0 0 32 VBottom 2
WINDOW 3 32 32 VTop 2
SYMATTR InstName D2
SYMATTR Value 1N4148
SYMBOL Opamps\\LT1013 4560 240 R0
SYMATTR InstName U38
SYMBOL Opamps\\LT1013 4608 752 R0
SYMATTR InstName U39
SYMBOL cap 1504 1104 R90
WINDOW 0 0 32 VBottom 2
WINDOW 3 32 32 VTop 2
SYMATTR InstName C5
SYMATTR Value 100n
SYMBOL cap 1472 -160 R90
WINDOW 0 0 32 VBottom 2
WINDOW 3 32 32 VTop 2
SYMATTR InstName C6
SYMATTR Value 1µ
TEXT -1696 864 Left 2 !.tran 0 0.102 0.1 0.001 uic
TEXT 5664 640 Left 2 ;YANGIN 2
TEXT 5704 32 Left 2 ;YANGIN 1
TEXT 5704 280 Left 2 ;YANGIN 3
TEXT 5640 1288 Left 2 ;YANGIN YOK
TEXT -1344 -408 Left 2 ;Non-Inverting Amplifier
TEXT -1720 936 Left 2 ;Idle State Comparators
TEXT -600 -408 Left 2 ;Temperature Comparators
TEXT 4176 120 Left 2 ;Envelope Detector (Sine to DC Converter)
TEXT 3416 32 Left 2 ;Band Pass Filters
TEXT 1824 152 Left 2 ;AB Stage
TEXT 2496 136 Left 2 ;Microphone Volume Adjustment
TEXT 2112 -1040 Left 2 ;To simulate Vspeaker Vmic Relationship
TEXT 4960 -408 Left 2 ;Fire Alarm LED's
TEXT 5088 856 Left 2 ;Idle LED
TEXT -1728 -416 Left 2 ;Voltage Sources
TEXT 1320 -400 Left 2 ;Sine Wave Genarator (RC Oscillator Circuit)
RECTANGLE Normal -624 896 -1360 -432 2
RECTANGLE Normal -624 1664 -1744 912 2
RECTANGLE Normal 528 1504 -608 -432 2
RECTANGLE Normal 2464 1008 1808 112 2
RECTANGLE Normal 5808 816 4928 -432 2
RECTANGLE Normal 5808 1536 4928 816 2
RECTANGLE Normal 3040 -640 2096 -1056 2
RECTANGLE Normal 4144 1104 3408 16 2
RECTANGLE Normal 4912 1024 4160 96 2
RECTANGLE Normal 3392 1024 2480 112 2
RECTANGLE Normal -1744 896 -1376 -432 2
RECTANGLE Normal 1792 1504 544 -432 2

The netlist it stands for:
* EE214_HalisYılmaz_RafetKavak_CircuitSchematic.asc
V1 Vsensor1 0 0.6
V2 Vsensor2 0 0.8
V3 Vsensor3 0 0.9
XU1 Vsensor1 N007 +Vcc2 -Vcc2 Vsensor1.1 LT1013  ; pins In+ In- V+ V- OUT
R13 0 N007 1k
R14 N007 Vsensor1.1 4.7k
XU2 Vsensor2 N027 +Vcc2 -Vcc2 Vsensor2.1 LT1013  ; pins In+ In- V+ V- OUT
R15 0 N027 1k
R16 N027 Vsensor2.1 4.7k
XU3 Vsensor3 N047 +Vcc2 -Vcc2 Vsensor3.1 LT1013  ; pins In+ In- V+ V- OUT
R17 0 N047 1k
R18 N047 Vsensor3.1 4.7k
XU4 Vsensor1.1 Vsensor2.1 Valarm 0 N002 LT1013  ; pins In+ In- V+ V- OUT
Q2 +Vcc2 N003 N012 0 BC547C
Q3 N012 N016 N019 0 BC547C
R25 N019 0 1k
XU5 Vsensor1.1 Vsensor3.1 Valarm 0 N015 LT1013  ; pins In+ In- V+ V- OUT
R26 N003 N002 10k
R27 N016 N015 10k
XU6 Vsensor3.1 Vsensor1.1 Valarm 0 N035 LT1013  ; pins In+ In- V+ V- OUT
Q6 +Vcc2 N036 N043 0 BC547C
Q7 N043 N049 N054 0 BC547C
R28 N054 0 1k
XU7 Vsensor3.1 Vsensor2.1 Valarm 0 N048 LT1013  ; pins In+ In- V+ V- OUT
R29 N036 N035 10k
R30 N049 N048 10k
V6 +Vcc2 0 12
XU10 N054 V3 +Vcc2 -Vcc2 V3 LT1013  ; pins In+ In- V+ V- OUT
XU11 N019 V1 +Vcc2 -Vcc2 V1 LT1013  ; pins In+ In- V+ V- OUT
XU9 N042 N033 +Vcc2 -Vcc2 N034 LT1013  ; pins In+ In- V+ V- OUT
R9 N042 Vsin3 1k
R10 N042 Vsin5 1k
R11 N034 N033 100k
R12 N033 0 1k
R19 N034 0 1k
V7 0 -Vcc2 12
D5 N037 Vsum 1N4148
D6 Vsum N057 1N4148
R20 +Vcc2 N037 560
R21 N057 -Vcc2 560
Q5 -Vcc2 N057 Vspeaker 0 2SAR554P
Q10 +Vcc2 N037 Vspeaker 0 2SCR554P
XU15 N034 N039 +Vcc2 -Vcc2 N039 LT1013  ; pins In+ In- V+ V- OUT
Rspeaker Vspeaker 0 50
R43 +Vcc2 Vmic 20k
C15 N046 Vmic 680n
R44 N040 N046 3.9k
XU19 N056 N040 +Vcc2 -Vcc2 N041 LT1013  ; pins In+ In- V+ V- OUT
R45 N056 0 100k
Rpot N041 N040 500k
XU20 N001 Vmic +Vcc2 -Vcc2 Vmic LT1013  ; pins In+ In- V+ V- OUT
R47 N001 0 1k
R48 N001 Vspeaker 199k
XU21 N041 Vmic2 +Vcc2 -Vcc2 Vmic2 LT1013  ; pins In+ In- V+ V- OUT
R50 N029 Vmic2 28.4k
R51 N029 0 557
C16 N026 N029 4.7n
XU22 0 N030 +Vcc2 -Vcc2 N026 LT1013  ; pins In+ In- V+ V- OUT
C17 N030 N029 4.7n
R54 N026 N030 227k
R37 N058 Vmic2 17k
R38 N058 0 360
C11 N051 N058 4.7n
XU17 0 N059 +Vcc2 -Vcc2 N051 LT1013  ; pins In+ In- V+ V- OUT
C12 N059 N058 4.7n
R39 N051 N059 136k
D3 N026 N032 1N4148
C7 N032 0 1µ
R22 N032 0 100k
D8 N051 N061 1N4148
C8 N061 0 1µ
R23 N061 0 100k
Q13 +Vcc2 N038 N045 0 BC547C
Q14 N045 N050 N052 0 BC547C
R24 N038 Vbpf3 10k
R34 N050 Vbpf5 10k
R35 0 N052 1k
D§YANGIN2 N053 0 D
R36 N053 N052 330
D§YANGIN3 N024 N025 D
R58 N024 N009 330
D§YANGIN1 N010 N011 D
R59 N010 N009 330
R60 N017 Vbpf3 10k
R61 N023 Vbpf5 10k
Q15 N009 N017 N022 0 BC547C
Q16 N022 N023 0 0 BC547C
R62 +Vcc2 N009 1k
XU14 N031 Vbpf3 +Vcc2 -Vcc2 Vbpf3 LT1013  ; pins In+ In- V+ V- OUT
XU16 N060 Vbpf5 +Vcc2 -Vcc2 Vbpf5 LT1013  ; pins In+ In- V+ V- OUT
V8 +V2 0 1.7
XU24 Vsensor1.1 +V2 +Vcc2 0 N069 LT1013  ; pins In+ In- V+ V- OUT
XU25 Vsensor2.1 +V2 +Vcc2 0 N080 LT1013  ; pins In+ In- V+ V- OUT
XU26 Vsensor3.1 +V2 +Vcc2 0 N086 LT1013  ; pins In+ In- V+ V- OUT
Q17 +Vcc2 N070 N071 0 NPN
Q18 +Vcc2 N081 N071 0 NPN
Q19 +Vcc2 N087 N071 0 NPN
R63 N070 N069 10k
R64 N081 N080 10k
R65 N087 N086 10k
R66 N071 0 1k
R67 N074 Vbpf3 10k
R68 N084 Vbpf5 10k
Q20 N068 N074 0 0 BC547C
Q21 N068 N084 0 0 BC547C
R69 +Vcc2 N068 1k
R70 N068 N079 100
D§YANGIN-YOK N079 0 D
XU27 N071 Valarm +Vcc2 -Vcc2 Valarm LT1013  ; pins In+ In- V+ V- OUT
Q11 N025 N028 0 0 BC547C
Q12 N011 P001 0 0 BC547C
XU29 Vsensor2.1 Vsensor1.1 Valarm 0 N065 LT1013  ; pins In+ In- V+ V- OUT
Q23 +Vcc2 N066 N075 0 BC547C
Q24 N075 N078 N083 0 BC547C
R72 N083 0 1k
XU30 Vsensor2.1 Vsensor3.1 Valarm 0 N077 LT1013  ; pins In+ In- V+ V- OUT
R73 N066 N065 10k
R74 N078 N077 10k
XU31 N083 V2 +Vcc2 -Vcc2 V2 LT1013  ; pins In+ In- V+ V- OUT
R33 P001 Vbpf3 1k
R46 N028 Vbpf5 1k
C22 Vsum N039 1µ
XU8 N014 N005 N004 N018 N006 LT1013  ; pins In+ In- V+ V- OUT
R1 N021 N014 5.3k
C1 N006 N021 10n
C2 0 N014 10n
R2 N014 0 5.3k
R3 N006 N005 20k
R4 N005 0 10k
XU12 N073 N063 N062 N076 N064 LT1013  ; pins In+ In- V+ V- OUT
R5 N082 N073 3.1k
C3 N064 N082 10n
C4 0 N073 10n
R6 N073 0 3.1k
R7 N064 N063 20k
R8 N063 0 10k
XU13 N006 N008 +Vcc2 -Vcc2 N008 LT1013  ; pins In+ In- V+ V- OUT
XU28 N064 N067 +Vcc2 -Vcc2 N067 LT1013  ; pins In+ In- V+ V- OUT
D9 V3 N062 1N4148
D10 V2 N062 1N4148
D11 V2 N004 1N4148
D12 V1 N004 1N4148
XU32 N019 N020 +Vcc2 -Vcc2 N020 LT1013  ; pins In+ In- V+ V- OUT
XU33 0 N013 +Vcc2 -Vcc2 -V1 LT1013  ; pins In+ In- V+ V- OUT
R31 N013 N020 1k
XU34 N054 N055 +Vcc2 -Vcc2 N055 LT1013  ; pins In+ In- V+ V- OUT
XU35 0 N044 +Vcc2 -Vcc2 -V3 LT1013  ; pins In+ In- V+ V- OUT
R32 N044 N055 1k
XU36 N083 N085 +Vcc2 -Vcc2 N085 LT1013  ; pins In+ In- V+ V- OUT
XU37 0 N072 +Vcc2 -Vcc2 -V2 LT1013  ; pins In+ In- V+ V- OUT
R75 N072 N085 1k
R76 -V1 N013 1k
R77 -V2 N072 1k
R78 -V3 N044 1k
D4 N018 -V1 1N4148
D7 N018 -V2 1N4148
D1 N076 -V2 1N4148
D2 N076 -V3 1N4148
XU38 N032 +V2 +Vcc 0 N031 LT1013  ; pins In+ In- V+ V- OUT
XU39 N061 +V2 +Vcc 0 N060 LT1013  ; pins In+ In- V+ V- OUT
C5 Vsin5 N067 100n
C6 Vsin3 N008 1µ
.model D D
.lib standard.dio
.model NPN NPN
.model PNP PNP
.lib standard.bjt
.tran 0 0.102 0.1 0.001 uic
* YANGIN 2
* YANGIN 1
* YANGIN 3
* YANGIN YOK
* Non-Inverting Amplifier
* Idle State Comparators
* Temperature Comparators
* Envelope Detector (Sine to DC Converter)
* Band Pass Filters
* AB Stage
* Microphone Volume Adjustment
* To simulate Vspeaker Vmic Relationship
* Fire Alarm LED's
* Idle LED
* Voltage Sources
* Sine Wave Genarator (RC Oscillator Circuit)
.lib LTC.lib
.backanno
.end